# EasyEDA Pro project ProPrj_MP2456_2024-10-30_10-07-32_2024-11-04.epro

# Schematic Schematic1
Board Name: Board1; Create Date: 2024-10-30
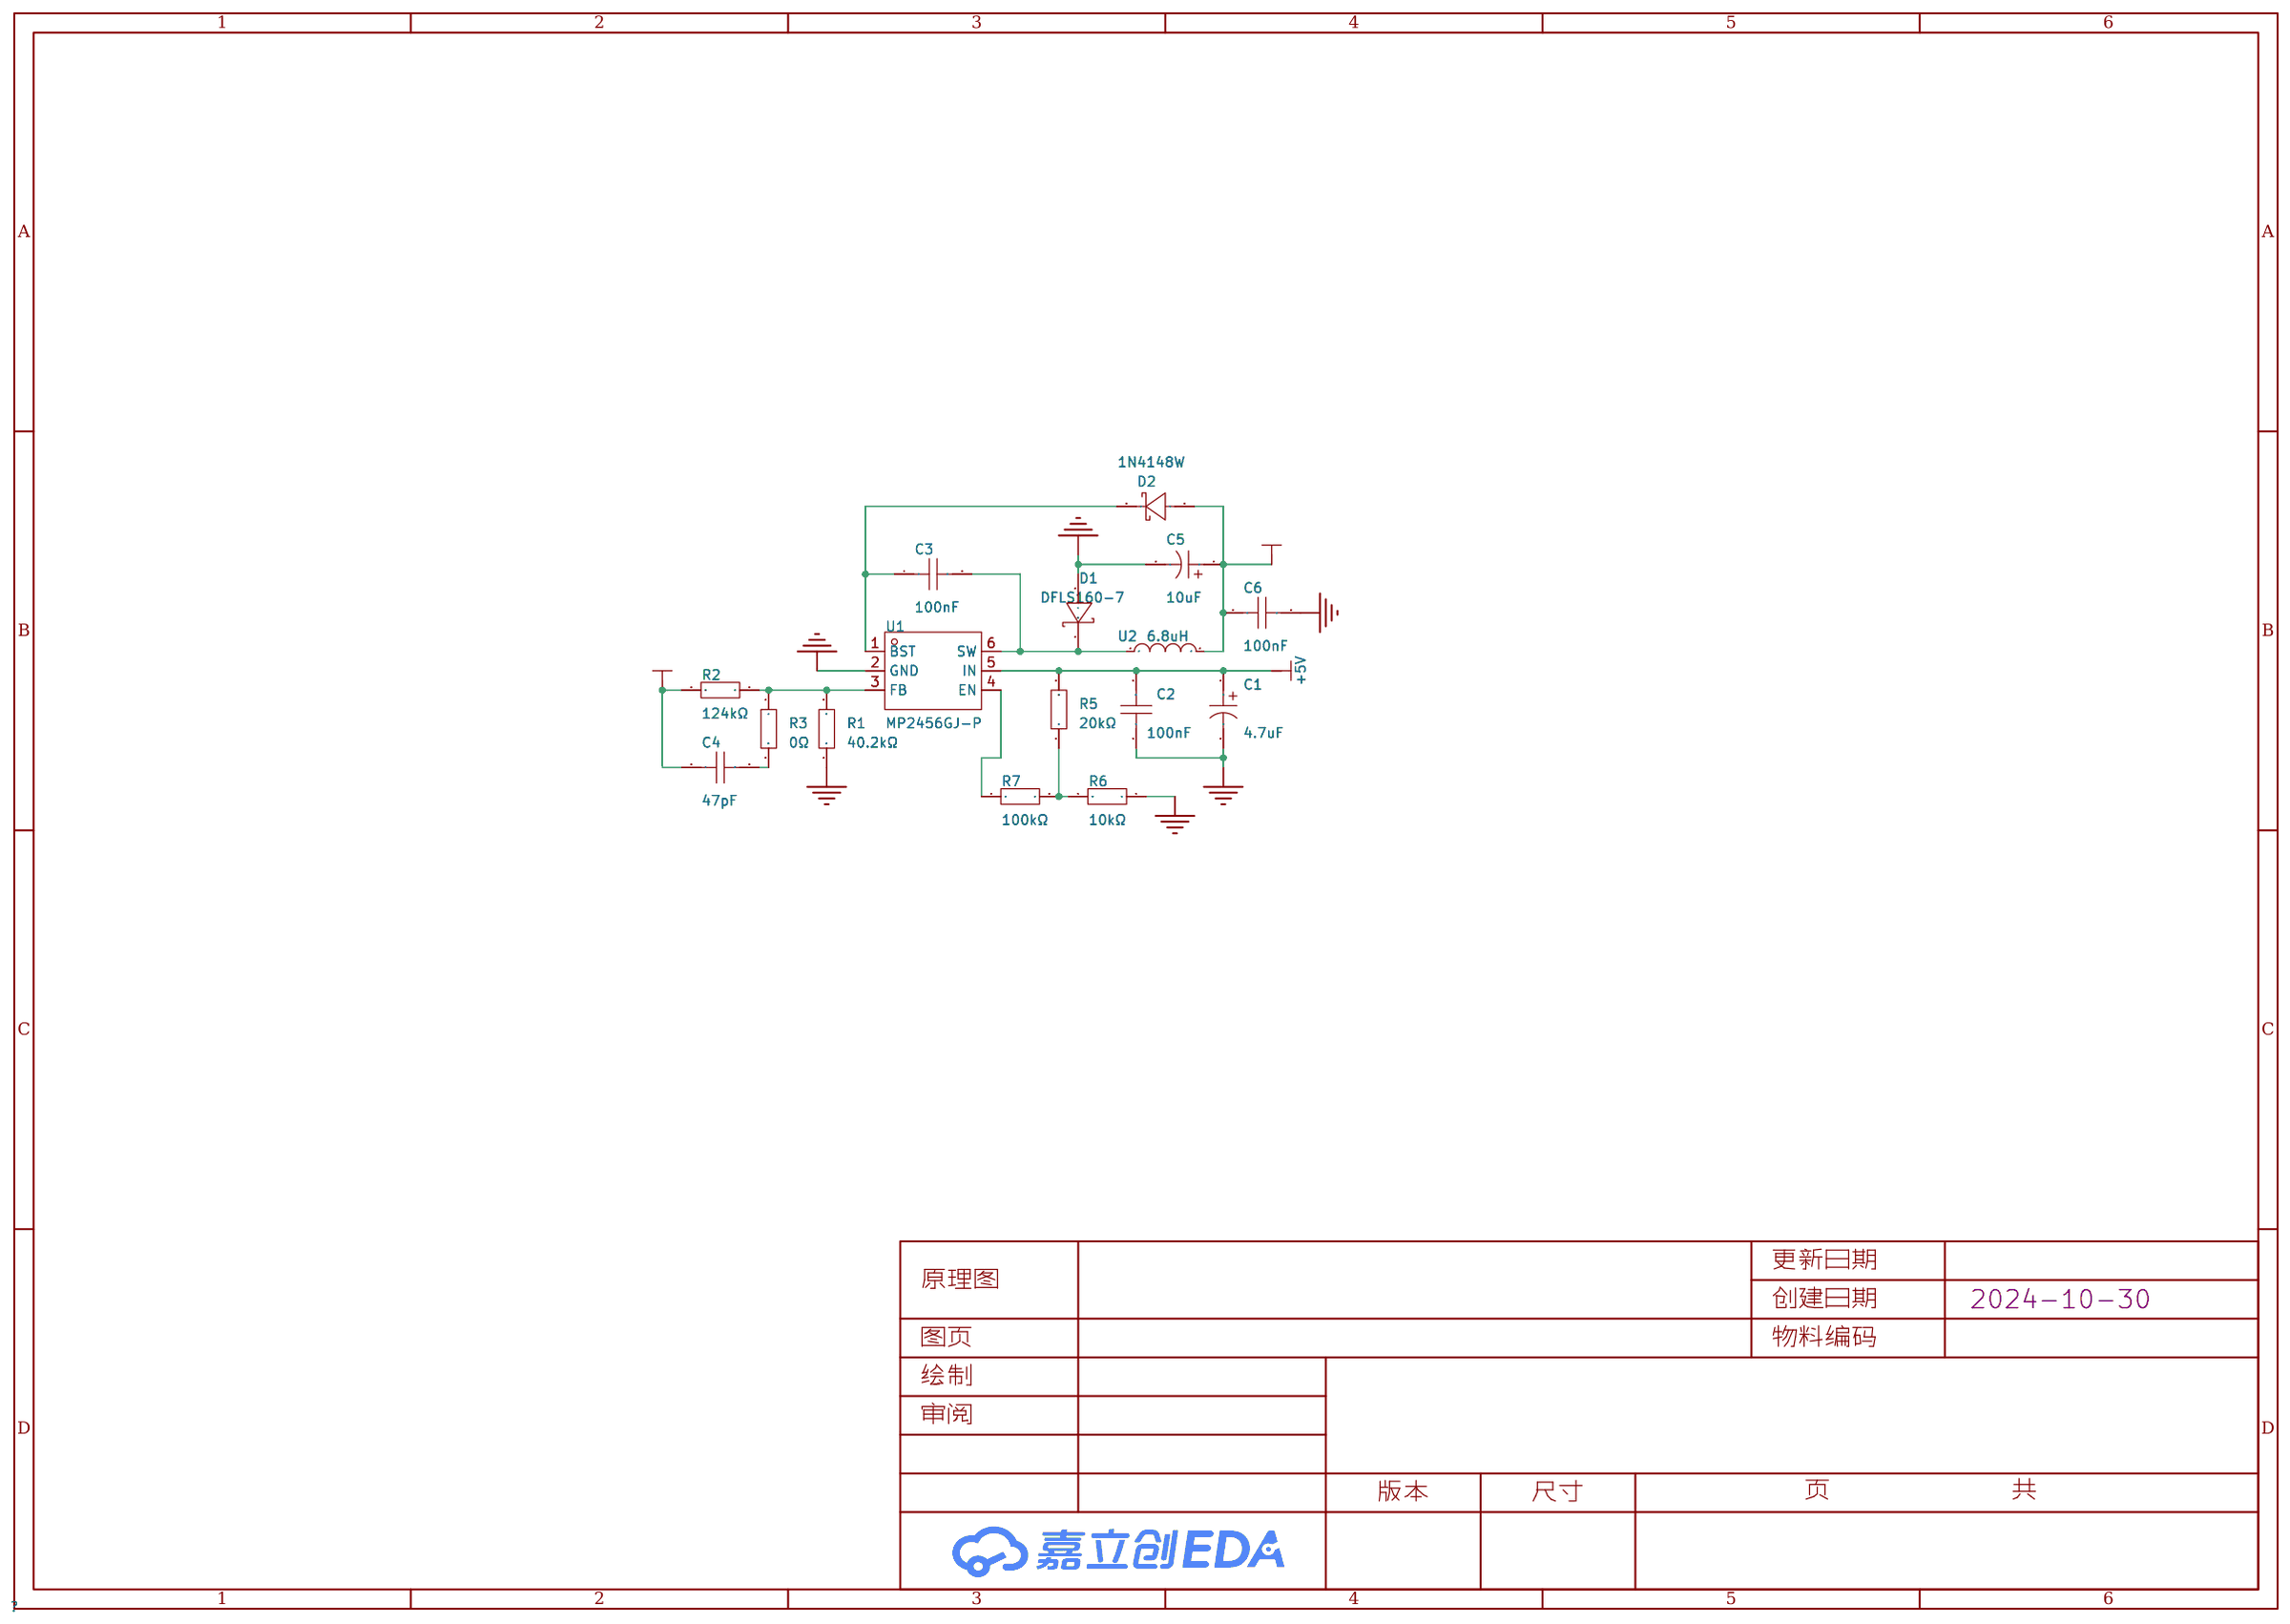
[diagram p0: schematic sheet]

## Parts
C1  4.7uF  [CAP-SMD_L3.5-W2.8]
C2  100nF  [C0603]
C3  100nF  [C0603]
C4  47pF  [C0603]
C5  10uF  [CAP-SMD_L3.2-W1.6]
C6  100nF  [C0603]
D1  DFLS160-7  [POWERDI-123_L2.8-W1.8-LS3.7-RD]
D2  1N4148W  [SOD-123_L2.7-W1.6-LS3.7-FD]
R1  40.2kΩ  [R0603]
R2  124kΩ  [R0603]
R3  0Ω  [R0603]
R5  20kΩ  [R0603]
R6  10kΩ  [R0603]
R7  100kΩ  [R0603]
U1  MP2456GJ-P  [TSOT-23-6_L2.9-W1.6-P0.95-LS2.8-BR]
U2  6.8uH  [IND-SMD_L2.5-W2.0_YXMBL252010P]

## Library data of the parts
C1 = CA45-B-16V-4.7μF-K: 容值:4.7uF;精度:±10%;额定电压:16V;等效串联电阻:3.5Ω@100kHz;; LCSC Part Name: 4.7uF ±10% 16V; Supplier Part: C503912; Manufacturer: TORCH(火炬); Supplier Footprint: 1210; JLCPCB Part Class: 扩展库; Supplier: LCSC; Tolerance: ±10%; Rated Voltage: 16V; Equivalent Series Resistance(ESR): 3.5Ω@100kHz; Operating Temperature: -55℃~+125℃
C2 C3 C6 = CGA0603X7R104K500JT: 容值:100nF;精度:±10%;额定电压:50V;材质(温度系数):X7R;; LCSC Part Name: 100nF ±10% 50V; Supplier Part: C6119867; Manufacturer: HRE(芯声); Supplier Footprint: 0603; JLCPCB Part Class: 扩展库; Supplier: LCSC; Tolerance: ±10%; Voltage Rated: 50V; Temperature Coefficient: X7R
C4 = CL10C470JB8NNNC: 容值:47pF;精度:±5%;额定电压:50V;材质(温度系数):C0G;; LCSC Part Name: 47pF ±5% 50V; Supplier Part: C1671; Manufacturer: SAMSUNG(三星); Supplier Footprint: 0603; JLCPCB Part Class: Basic Part; Datasheet: https://atta.szlcsc.com/upload/public/pdf/source/20160218/1457707763339.pdf; Supplier: LCSC; Tolerance: ±5%; Voltage Rated: 50V; Temperature Coefficient: C0G
C5 = TAJA106K016SNJ: 容值:10uF;精度:±10%;额定电压:16V;等效串联电阻:3Ω;; LCSC Part Name: 10uF ±10% 16V; Supplier Part: C2162859; Manufacturer: Kyocera AVX; Supplier Footprint: 1206; JLCPCB Part Class: Extended Part; Datasheet: https://atta.szlcsc.com/upload/public/pdf/source/20220428/D07DDBFE7707A20AC674855DE17B1C41.pdf; Supplier: LCSC; Tolerance: ±10%; Rated Voltage: 16V; Equivalent Series Resistance(ESR): 3Ω; Operating Temperature: -55℃~+125℃
D1 = DFLS160-7: 正向压降(Vf):500mV@1A;直流反向耐压(Vr):60V;平均整流电流(Io):1A;; LCSC Part Name: 电压:60V 电流:1A; Supplier Part: C177023; Manufacturer: DIODES(美台); Supplier Footprint: Power-DI-123; JLCPCB Part Class: 扩展库; Datasheet: https://atta.szlcsc.com/upload/public/pdf/source/20181114/C177023_80F0A2460033305602CFDDCB3101FB4E.pdf; Supplier: LCSC; Forward Voltage (Vf@If): 500mV@1A; Reverse Voltage (Vr): 60V; Average Rectified Current (Io): 1A
D2 = 1N4148W_C7420318: 二极管配置:独立式;正向压降(Vf):1.25V@150mA;直流反向耐压(Vr):100V;平均整流电流(Io):150mA;功率:400mW;反向恢复时间(trr):4ns;; LCSC Part Name: 电压:100V 电流:150mA; Supplier Part: C7420318; Manufacturer: 宏迦橙; Supplier Footprint: SOD-123; JLCPCB Part Class: 扩展库; Datasheet: https://atta.szlcsc.com/upload/public/pdf/source/20230828/E5C3F7A4272052930A7E03B75759BF50.pdf; Supplier: LCSC; Diode Configuration: 独立式; Forward Voltage (Vf@If): 1.25V@150mA; Reverse Voltage (Vr): 100V; Average Rectified Current (Io): 150mA; Power Dissipation: 400mW; Reverse Leakage Current: 1uA@75V; Reverse Recovery Time (trr): 4ns; Operating Temperature: -55℃~+150℃
R1 = RT0603BRD0740K2L: 电阻类型:薄膜电阻;阻值:40.2kΩ;精度:±0.1%;功率:100mW;最大工作电压:75V;温度系数:±25ppm/℃;; LCSC Part Name: 薄膜电阻 40.2kΩ ±0.1% 100mW; Supplier Part: C723489; Manufacturer: YAGEO(国巨); Supplier Footprint: 0603; JLCPCB Part Class: Extended Part; Datasheet: https://atta.szlcsc.com/upload/public/pdf/source/20200814/C723489_691AE394B817A6C709053B22DA054C7F.pdf; Supplier: LCSC; Type: 薄膜电阻; Tolerance: ±0.1%; Power(Watts): 100mW; Overload Voltage (Max): 75V; Temperature Coefficient: ±25ppm/℃; Operating Temperature Range: -55℃~+155℃
R2 = 0603WAF1243T5E: 电阻类型:厚膜电阻;阻值:124kΩ;精度:±1%;功率:100mW;最大工作电压:75V;温度系数:±100ppm/℃;; LCSC Part Name: 124kΩ ±1% 100mW 厚膜电阻; Supplier Part: C22788; Manufacturer: UNI-ROYAL(厚声); Supplier Footprint: 0603; JLCPCB Part Class: Extended Part; Datasheet: https://atta.szlcsc.com/upload/public/pdf/source/20200306/C422600_1E6D84923E4A46A82E41ADD87F860B5C.pdf; Supplier: LCSC; Type: 厚膜电阻; Tolerance: ±1%; Power(Watts): 100mW; Overload Voltage (Max): 75V; Temperature Coefficient: ±100ppm/℃; Operating Temperature Range: -55℃~+155℃
R3 = 0603WAF0000T5E: 电阻类型:厚膜电阻;阻值:0Ω;精度:±1%;功率:100mW;最大工作电压:75V;; LCSC Part Name: 0Ω ±1% 100mW 厚膜电阻; Supplier Part: C21189; Manufacturer: UNI-ROYAL(厚声); Supplier Footprint: 0603; JLCPCB Part Class: Basic Part; Datasheet: https://atta.szlcsc.com/upload/public/pdf/source/20200306/C422600_1E6D84923E4A46A82E41ADD87F860B5C.pdf; Supplier: LCSC; Type: 厚膜电阻; Tolerance: ±1%; Power(Watts): 100mW; Overload Voltage (Max): 75V; Operating Temperature Range: -55℃~+155℃
R5 = 0603WAF2002T5E: 电阻类型:厚膜电阻;阻值:20kΩ;精度:±1%;功率:100mW;最大工作电压:75V;温度系数:±100ppm/℃;; LCSC Part Name: 20kΩ ±1% 100mW 厚膜电阻; Supplier Part: C4184; Manufacturer: UNI-ROYAL(厚声); Supplier Footprint: 0603; JLCPCB Part Class: Basic Part; Datasheet: https://atta.szlcsc.com/upload/public/pdf/source/20200306/C422600_1E6D84923E4A46A82E41ADD87F860B5C.pdf; Supplier: LCSC; Type: 厚膜电阻; Tolerance: ±1%; Power(Watts): 100mW; Overload Voltage (Max): 75V; Temperature Coefficient: ±100ppm/℃; Operating Temperature Range: -55℃~+155℃
R6 = 0603WAF1002T5E: 电阻类型:厚膜电阻;阻值:10kΩ;精度:±1%;功率:100mW;最大工作电压:75V;温度系数:±100ppm/℃;; LCSC Part Name: 厚膜电阻 10kΩ ±1% 100mW; Supplier Part: C25804; Manufacturer: UNI-ROYAL(厚声); Supplier Footprint: 0603; JLCPCB Part Class: Basic Part; Datasheet: https://atta.szlcsc.com/upload/public/pdf/source/20200306/C422600_1E6D84923E4A46A82E41ADD87F860B5C.pdf; Supplier: LCSC; Type: 厚膜电阻; Tolerance: ±1%; Power(Watts): 100mW; Overload Voltage (Max): 75V; Temperature Coefficient: ±100ppm/℃; Operating Temperature Range: -55℃~+155℃
R7 = 0603WAF1003T5E: 电阻类型:厚膜电阻;阻值:100kΩ;精度:±1%;功率:100mW;最大工作电压:75V;温度系数:±100ppm/℃;; LCSC Part Name: 100kΩ ±1% 100mW 厚膜电阻; Supplier Part: C25803; Manufacturer: UNI-ROYAL(厚声); Supplier Footprint: 0603; JLCPCB Part Class: Basic Part; Datasheet: https://atta.szlcsc.com/upload/public/pdf/source/20200306/C422600_1E6D84923E4A46A82E41ADD87F860B5C.pdf; Supplier: LCSC; Type: 厚膜电阻; Tolerance: ±1%; Power(Watts): 100mW; Overload Voltage (Max): 75V; Temperature Coefficient: ±100ppm/℃; Operating Temperature Range: -55℃~+155℃
U1 = MP2456GJ-P: 功能类型:降压型;输出类型:可调;输入电压:4.5V~50V;输出电压:810mV~45V;输出电流:500mA;; Supplier Part: C7304445; Manufacturer: MPS(芯源); Supplier Footprint: TSOT-23-6; JLCPCB Part Class: 扩展库; Datasheet: https://atta.szlcsc.com/upload/public/pdf/source/20240130/7CFF9D8E2CDB4385150042CC809F2CE5.pdf; Supplier: LCSC; Function: 降压型; Output Type: 可调; Input Voltage: 4.5V~50V; Output Voltage: 810mV~45V; Output Current: 500mA; Switching Frequency: 1.2MHz; Operating Temperature: -40℃~+125℃@(TJ); Synchronous Rectification: 否; Number of Outputs: 1; Topology: 降压式; Switch tube (built-in/external): 内置
U2 = FTC252012S6R8MBCA: 电感值:6.8uH;精度:±20%;额定电流:1.6A;饱和电流(Isat):2A;类型:一体成型电感;; LCSC Part Name: 6.8uH ±20% 2A; Supplier Part: C5832375; Manufacturer: cjiang(长江微电); Supplier Footprint: SMD,2x2.5mm; JLCPCB Part Class: Extended Part; Datasheet: https://atta.szlcsc.com/upload/public/pdf/source/20230602/8FFEDA9C0247A92A0D4B67554BFE4091.pdf; Supplier: LCSC; Tolerance: ±20%; Rated Current: 1.6A; Saturation Current (Isat): 2A; DC Resistance (DCR): 245mΩ; Type: 一体成型电感

## Nets
3.3V: C4.1 C5.1 C6.1 D2.1(A) R2.2 U2.2
+5V: C1.1 C2.2 R5.2 U1.5(IN)
GND: C1.2 C2.1 C5.2 C6.2 D1.2(A) R1.1 R6.1 U1.2(GND)
$1N253: R1.2 R2.1 R3.1 U1.3(FB)
$1N904: C3.2 D1.1(C) U1.6(SW) U2.1
$1N988: C3.1 D2.2(K) U1.1(BST)
$1N1188: C4.2 R3.2
$1N1367: R7.1 U1.4(EN)
$1N1371: R5.1 R6.2 R7.2

# Board PCB1
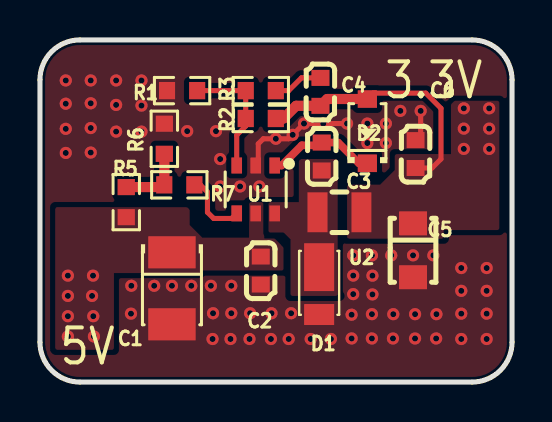
[diagram p1: board, top side]
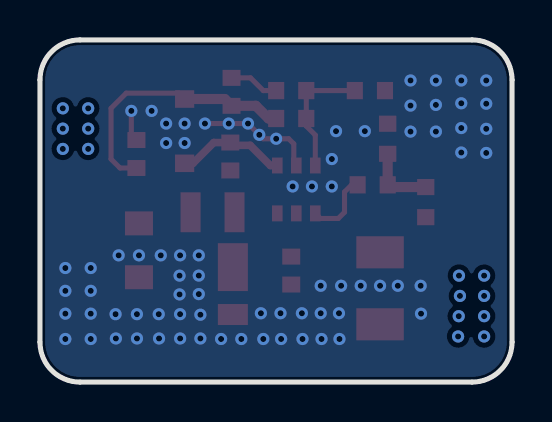
[diagram p2: board, bottom side, seen from below]

Outline 23.62 x 17.14 mm; copper layers: Top Layer, Bottom Layer. Coordinates in mm from the lower left corner of the outline.
Outline path: 0,15.14 0,2 arc(0.59,0.59) 2,0 21.62,0 arc(23.04,0.59) 23.62,2 23.62,15.14 arc(23.04,16.56) 21.62,17.14 2,17.14 arc(0.59,16.56) 0,15.14
Stack: Top Layer 0.035mm / Dielectric1 1.51mm FR4 er 4.5 / Bottom Layer 0.035mm

## Design rules (mm)
template: 自定义配置
spacing copperThickness1oz (default): track to track 0.102, other pairs 0.152 to 0.3
spacing copperThickness2oz: track to track 0.203, other pairs 0.152 to 0.3
track width copperThickness1oz (default): min 0.127, default 0.254, max 2.54
track width copperThickness2oz: min 0.203, default 0.254, max 2.54
differential pair differentialPair (default): width min 0.127, default 0.254, max 2.54; gap min 0.152, default 0.152
via viaSize (default): diameter min 0.5, default 0.61, max 10; hole min 0.3, default 0.305, max 6.3
net GND uses copperRegion1
net +5V uses copperRegion1
net $1N904 uses copperRegion1
net 3.3V uses copperRegion1

## Placement (name value [footprint] x y rotation side)
C1  4.7uF  [CAP-SMD_L3.5-W2.8]  6.6 4.7 90 top
C2  100nF  [C0603]  11.05 5.59 90 top
C3  100nF  [C0603]  14.1 11.3 270 top
C4  47pF  [C0603]  14.03 14.54 90 top
C5  10uF  [CAP-SMD_L3.2-W1.6]  18.67 6.6 270 top
C6  100nF  [C0603]  18.8 11.43 90 top
D1  DFLS160-7  [POWERDI-123_L2.8-W1.8-LS3.7-RD]  13.97 4.57 270 top
D2  1N4148W  [SOD-123_L2.7-W1.6-LS3.7-FD]  16.38 12.57 270 top
R1  40.2kΩ  [R0603]  7.11 14.6 0 top
R2  124kΩ  [R0603]  11.05 13.21 0 top
R3  0Ω  [R0603]  11.05 14.6 0 top
R5  20kΩ  [R0603]  4.32 9.02 270 top
R6  10kΩ  [R0603]  6.22 12.19 270 top
R7  100kΩ  [R0603]  6.97 9.88 180 top
U1  MP2456GJ-P  [TSOT-23-6_L2.9-W1.6-P0.95-LS2.8-BR]  10.79 9.65 90 top
U2  6.8uH  [IND-SMD_L2.5-W2.0_YXMBL252010P]  14.99 8.51 180 top

## Footprints (pads in the part's own frame, mm; a bottom-side part is the same pattern mirrored in y, then rotated)
C0603
  rect 0.8x0.9 smd: 1(-0.7,0) 2(0.7,0)
CAP-SMD_L3.2-W1.6
  rect 1.2x1.4 smd: 1(-1.35,0) 2(1.35,0)
CAP-SMD_L3.5-W2.8
  rect 1.607x2.376 smd: 1(1.804,0) 2(-1.804,0)
IND-SMD_L2.5-W2.0_YXMBL252010P
  rect 1x2 smd: 1(1.1,0) 2(-1.1,0)
POWERDI-123_L2.8-W1.8-LS3.7-RD
  rect 2.4x1.5 smd: 1(-1.188,0)
  rect 1.05x1.5 smd: 2(1.188,0)
R0603
  rect 0.806x0.864 smd: 1(-0.753,0) 2(0.753,0)
SOD-123_L2.7-W1.6-LS3.7-FD
  rect 0.88x0.96 smd: 1(-1.61,0) 2(1.61,0)
TSOT-23-6_L2.9-W1.6-P0.95-LS2.8-BR
  rect 0.8x0.532 smd: 1(1.2,-0.95) 2(1.2,0) 3(1.2,0.95) 4(-1.2,0.95) 5(-1.2,0) 6(-1.2,-0.95)

## Nets
As in the schematic.

## Via types
v1: diameter 0.61, hole 0.305, Top Layer to Bottom Layer, 91 vias

## Routing (per net, layer and track width the routed paths; a pad name or vN(x,y) marks a point on that pad's centre or on a via; arc(x,y) is an arc through that point)
3.3V: length 13.1
  Top Layer w0.254: C6.1 19.62,10.73 20.07,11.18 20.07,13.72 19.3,14.48 16.68,14.48 D2.1
  Top Layer w0.508: D2.1 14.38,14.18 C4.1 12.82,13.84 12.18,13.21 R2.2
  vias: v1(21.21,13.72) v1(21.21,12.7) v1(21.21,11.68) v1(22.48,13.72) v1(22.48,12.7) v1(22.48,11.68)
+5V:
  vias: v1(1.4,5.33) v1(1.4,4.32) v1(1.4,3.3) v1(1.4,2.29) v1(2.66,5.33) v1(2.61,4.32) v1(2.67,3.3) v1(2.7,2.29)
GND: length 7.6
  Top Layer w0.254: v1(15.37,12.95) v1(14.18,12.95) v1(13.21,12.95) 12.45,12.19 v1(11.8,12.19) 11.18,12.19 10.92,11.94 10.92,10.98 U1.2 ; v1(19.05,13.59) 19.05,12.38 C6.2
  vias: v1(1.29,15.11) v1(1.29,13.95) v1(1.29,12.69) v1(1.29,11.48) v1(2.54,15.11) v1(2.54,13.97) v1(2.54,12.73) v1(2.54,11.5) v1(3.81,15.11) v1(3.81,13.89) v1(3.81,12.55) v1(4.55,3.43) v1(4.57,4.83) v1(5.08,15.11) v1(5.08,13.85) v1(5.08,12.55) v1(5.72,4.83) v1(6.6,4.83) v1(7.37,12.57) v1(7.57,4.83) v1(8.55,4.83) v1(8.64,2.16) v1(8.66,3.45) v1(8.81,12.57) v1(9.02,11.18) v1(9.02,9.8) v1(9.53,2.16) v1(9.57,4.83) v1(9.57,3.45) v1(10.01,9.8) v1(10.52,3.45) v1(10.48,2.16) v1(10.98,9.8) v1(11.56,2.16) v1(11.59,3.45) v1(12.45,2.16) v1(12.65,12.39) v1(12.57,3.45) v1(13.55,2.16) v1(14.56,2.16) v1(15.59,3.38) v1(15.59,2.19) v1(15.67,6.35) v1(15.67,5.34) v1(15.67,4.41) v1(16.38,12.95) v1(16.38,11.98) v1(16.61,6.35) v1(16.64,5.33) v1(16.64,4.39) v1(16.61,3.4) v1(16.61,2.19) v1(17.31,12.95) v1(17.31,11.98) v1(17.58,6.35) v1(17.68,3.4) v1(17.66,2.19) v1(18.03,13.59) v1(18.67,6.35) v1(18.77,3.4) v1(18.77,2.19) v1(19.69,6.35) v1(19.84,3.4) v1(19.82,2.19) v1(21.08,5.71) v1(21.08,4.57) v1(21.08,3.43) v1(21.08,2.16) v1(22.35,5.71) v1(22.35,4.57) v1(22.35,3.43) v1(22.35,2.16)
$1N253: length 6.4
  Top Layer w0.254: U1.3 9.84,12.38 10.3,12.83 R3.1 R1.2
$1N988: length 5.5
  Top Layer w0.381: D2.2 15.96,10.96 14.92,12 C3.1 13.96,11.86 13.1,11.86 12.09,10.85 U1.1
$1N1188: length 2.5
  Top Layer w0.254: R3.2 12.45,14.6 13.08,15.24 C4.2
$1N1367: length 3.5
  Top Layer w0.254: R7.1 8.02,9.88 8.38,9.52 8.38,8.51 8.69,8.2 9.59,8.2 U1.4
$1N1371: length 3.5
  Top Layer w0.508: R5.1 6.11,9.77 6.22,9.88 6.22,9.89 R6.2

## Copper pours and planes (outline as drawn; the poured copper is in the pictures)
3.3V on Top Layer: 17.85,11.42 20.57,11.42 20.57,13.92 20.75,14.1 22.99,14.1 22.99,7.62 18.32,7.62 18.01,7.31 18.01,11.26
3.3V on Top Layer: 17.02,9.89 17.75,10.63 17.75,11.42 20.21,11.42 20.21,7.19 15.37,7.19 15.37,9.89
+5V on Top Layer: 11.22,9.02 11.22,7.19 11.74,7.19 12.19,6.74 12.19,5.59 8.13,5.59 8,5.46 3.7,5.46 3.7,1.62 0.79,1.62 0.76,1.65 0.76,8.77 3.55,8.77 3.55,8.76 7.37,8.76 7.49,8.64 7.49,7.87 8.13,7.24 10.46,7.24 10.46,9.01 10.5,9.02
GND on Top Layer: 10.54,11.68 11.18,11.68 11.18,9.4 8.76,9.4 8.76,11.05 7.62,12.19 3.56,12.19 3.56,15.49 7.11,15.49 7.11,12.83 9.3,12.83 9.3,10.38 9.4,10.29 10.41,10.29 10.54,10.41
GND on Top Layer: 0.9,15.52 5.33,15.52 5.33,11.18 0.9,11.18
GND on Top Layer: -0.25,17.4 24,17.4 24,-0.13 -0.25,-0.13
GND on Bottom Layer: -0.13,17.4 24,17.4 24,-0.13 -0.13,-0.13
$1N904 on Top Layer: 11.43,9.02 12.95,9.02 12.95,11.18 14.9,11.18 14.9,4.4 14.99,4.32 12.54,4.32 12.54,7.15 12.19,7.49 11.43,7.49

## Text on the board
Top Silkscreen Layer: 5V | 3.3V
